# Altium project a2c.PrjPcb
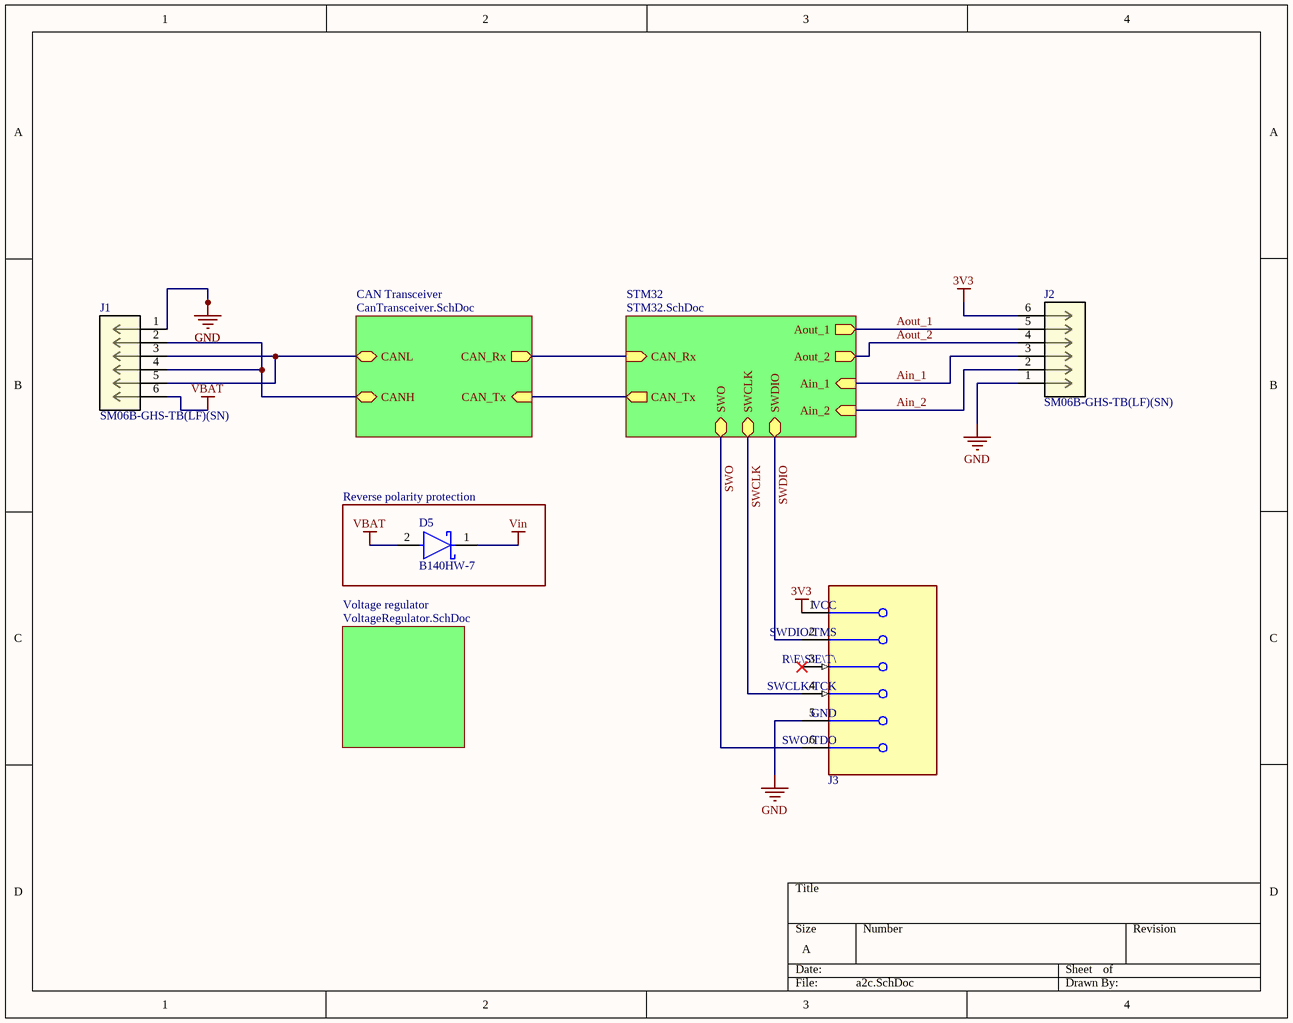
[diagram p0: a2c.SchDoc]
4 sheets, 40 parts. Net scope: hierarchical (ports join the sheet entries above them; power ports are global).
Board file: PCB.PcbDoc
Sheets:
  a2c.SchDoc
    STM32 = STM32.SchDoc
    Voltage regulator = VoltageRegulator.SchDoc
    CAN Transceiver = CanTransceiver.SchDoc

## Sheet a2c.SchDoc
size A; SheetNumber: 1; SheetTotal: 4

### Parts
D5  B140HW-7  [FP-SOD123-MFG]
J1  SM06B-GHS-TB(LF)(SN)  [CONN_SM06B-GHS-TB_JST]
J2  SM06B-GHS-TB(LF)(SN)  [CONN_SM06B-GHS-TB_JST]
J3  TC2030-CTX-NL  [Tag_Connect_0_MFG]  (value not drawn)

### Blocks framed on the sheet
Reverse polarity protection: D5

### Sub-sheets
CAN Transceiver = CanTransceiver.SchDoc: CAN_Tx (in), CAN_Rx (out), CANH (bidir), CANL (bidir)
STM32 = STM32.SchDoc: CAN_Tx (out), CAN_Rx (in), Aout_1 (out), Aout_2 (out), Ain_1 (in), Ain_2 (in), SWDIO (bidir), SWCLK (bidir), SWO (bidir)
Voltage regulator = VoltageRegulator.SchDoc: no entries

### Nets
3V3: J2.6 J3.1(VCC)
GND: J1.1 J2.1 J3.5(GND)
VBAT: D5.2(A) J1.6
Vin: D5.1(C)
Ain_1: J2.3 ; sheet STM32/Ain_1
Ain_2: J2.2 ; sheet STM32/Ain_2
Aout_1: J2.5 ; sheet STM32/Aout_1
Aout_2: J2.4 ; sheet STM32/Aout_2
SWCLK: J3.4(SWCLK/TCK) ; sheet STM32/SWCLK
SWDIO: J3.2(SWDIO/TMS) ; sheet STM32/SWDIO
SWO: J3.6(SWO/TDO) ; sheet STM32/SWO
NetD6_1: J1.3 J1.5 ; sheet CAN Transceiver/CANL
NetD6_2: J1.2 J1.4 ; sheet CAN Transceiver/CANH
NetU1_21: sheet STM32/CAN_Rx, sheet CAN Transceiver/CAN_Rx
NetU1_22: sheet STM32/CAN_Tx, sheet CAN Transceiver/CAN_Tx

Not connected (* = marked no-connect by the designer): J3 3(~{RESET})*

### Library data of the parts
D5 = CMP-12790-000013-1: DIODE SCHOTTKY 40V 1A SOD123; Manufacturer: Diodes Inc.; Peak Reverse Current: 40uA; Value: 120pF; Standoff Height: 0mm; Max Junction Temp: +125°C; Max Surge Forward Current: 16A; RoHS: TRUE; Ipc Land Pattern Name: SOD365155X110-2; Reverse Voltage: 40V; Temperature Range Low: -65°C; Capacitance: 120pF; Temperature Range High: +125°C; Mouser Description: Schottky Diodes & Rectifiers SCHOTTKY RECTIFIER SOD-123 1.0A 40V; ComponentLink2URL: https://www.diodes.com/assets/Datasheets/ds30670.pdf; Automotive: No; Package: SOD123; Octopart: https://octopart.com/b140hw-7-diodes+inc.-325751; Footprint Url: https://www.diodes.com/assets/Package-Files/SOD123.pdf; Max Repetitive Reverse Voltage: 40V; Category: Diode; Device Class L3: Schottky Diodes; Manufacturer Part Number: B140HW-7; Digikey Description: DIODE SCHOTTKY 40V 1A SOD123; Lead Free: Yes; Device Class L1: Discrete Semiconductors; ComponentLink2Description: Datasheet; Forward Current: 1A; Device Class L2: Diodes; Temperature: -65°C to +125°C; Height: 1.45mm
J1 J2 = SM06B-GHS-TB(LF)(SN): No Description Available; Manufacturer: JST; Manufacturer Part Number: B6B-ZR-SM4-TF(LF)(SN); Conn Orientation: Straight; Pitch: 1.5mm; Current Rating: 1A; Number Of Contacts: 6; Conn Gender: Male; Height: 5mm; Device Class L1: Connectors; Device Class L3: unset; Octopart: https://octopart.com/b6b-zr-sm4-tf%28lf%29%28sn%29-jst-248849; Package: B6B-ZR-SM4-TF(LF)(SN); Contact Material: Tin; Automotive: No; ComponentLink2URL: http://www.jst-mfg.com/product/pdf/eng/eZH.pdf; Digikey Description: CONN HEADER SMD 6POS 1.5MM; ComponentLink2Description: Datasheet; Temperature: -25°C to +85°C; Temperature Range Low: -25°C; Temperature Range High: +85°C; Number Of Rows: 1; RoHS: TRUE; Device Class L2: Board to Board Connectors; Lead Free: Yes; Category: Conn; Copyright: Copyright (C) 2021 Ultra Librarian. All rights reserved.; Digi-Key_Part_Number_1: 455-1568-2-ND; Digi-Key_Part_Number_2: 455-1568-1-ND; Digi-Key_Part_Number_3: 455-1568-6-ND; Manufacturer_Part_Number: SM06B-GHS-TB(LF)(SN); Mfr_Name: JST; RefDes: RefDes; Type: DEV

## Sheet STM32.SchDoc
size A; SheetNumber: 2; SheetTotal: 4
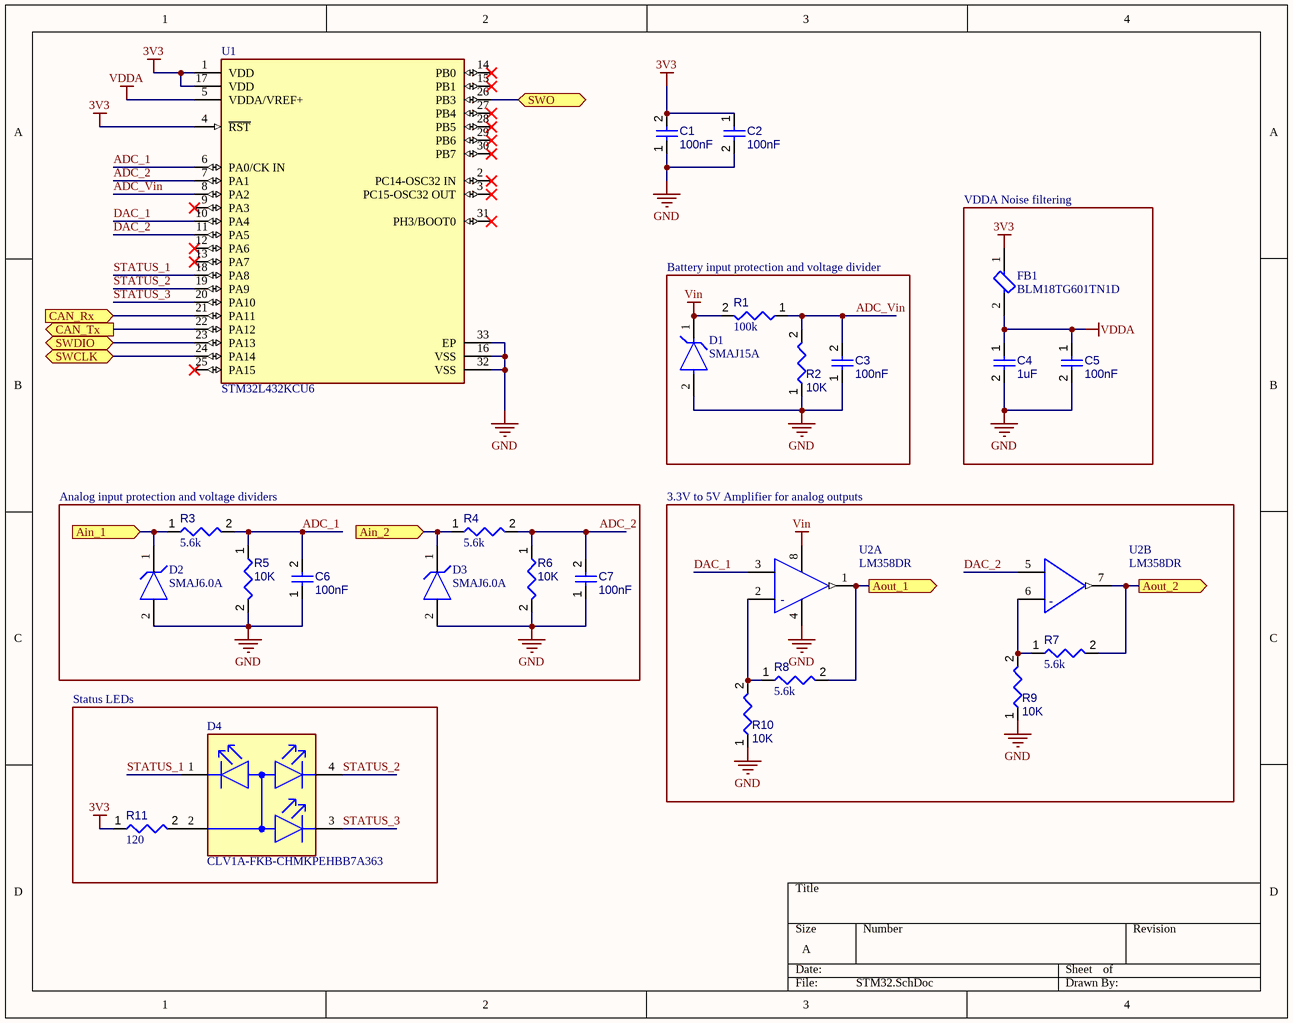
[diagram p1: STM32.SchDoc]

### Parts
C1  100nF  [CAPC0402(1005)60_L]
C2  100nF  [CAPC0402(1005)60_L]
C3  100nF  [CAPC0402(1005)60_L]
C4  1uF  [CAPC0402(1005)60_L]
C5  100nF  [CAPC0402(1005)60_L]
C6  100nF  [CAPC0402(1005)60_L]
C7  100nF  [CAPC0402(1005)60_L]
D1  SMAJ15A  [FP-SMA-MFG]
D2  SMAJ6.0A  [FP-SMA-MFG]
D3  SMAJ6.0A  [FP-SMA-MFG]
D4  CLV1A-FKB-CHMKPEHBB7A363  [FP-CLV1A-FKB-CHMKPEHBB7A3-MFG]
FB1  BLM18TG601TN1D  [FP-BLM18-0_15-0_1-t0_6-MFG]
R1  value 100k  [RESC0402(1005)_L]  (hidden comment: Resistor 100K +/-1 % 0402 63 mW)
R2  10K  [RESC0402(1005)_L]
R3  value 5.6k  [RESC0402(1005)_L]  (hidden comment: Resistor 5K6  +/-5 % 0402 63 mW)
R4  value 5.6k  [RESC0402(1005)_L]  (hidden comment: Resistor 5K6  +/-5 % 0402 63 mW)
R5  10K  [RESC0402(1005)_L]
R6  10K  [RESC0402(1005)_L]
R7  value 5.6k  [RESC0402(1005)_L]  (hidden comment: Resistor 5K6  +/-5 % 0402 63 mW)
R8  value 5.6k  [RESC0402(1005)_L]  (hidden comment: Resistor 5K6  +/-5 % 0402 63 mW)
R9  10K  [RESC0402(1005)_L]
R10  10K  [RESC0402(1005)_L]
R11  value 120  [RESC0603(1608)_L]  (hidden comment: Resistor 120R +/-5 % 0603 0.1 W)
U1  STM32L432KCU6  [FP-UFQFPN32-A0B8-MFG]
U2  LM358DR  [FP-D0008A-MFG]  (parts A,B of 2)

### Blocks framed on the sheet
VDDA Noise filtering: C4 C5 FB1
Battery input protection and voltage divider: C3 D1 R1 R2
Analog input protection and voltage dividers: C6 C7 D2 D3 R3-R6
3.3V to 5V Amplifier for analog outputs: R7-R10 U2
Status LEDs: D4 R11

### Ports
Ain_1 (in), Ain_2 (in), Aout_1 (out), Aout_2 (out), CAN_Rx (in), CAN_Tx (out), SWCLK (bidir), SWDIO (bidir), SWO (bidir)

### Nets
3V3: C1.2 C2.1 FB1.1 R11.1 U1.1(VDD) U1.4(~{RST}) U1.17(VDD)
GND: C1.1 C2.2 C3.1 C4.2 C5.2 C6.1 C7.1 D1.2(A) D2.2(A) D3.2(A) R2.1 R5.2 R6.2 R9.1 R10.1 U1.16(VSS) U1.32(VSS) U1.33(EP) U2.4(V-)
VDDA: C4.1 C5.1 FB1.2 U1.5(VDDA/VREF+)
Vin: D1.1(C) R1.2 U2.8(V+)
ADC_1: C6.2 R3.2 R5.1 U1.6(PA0/CK_IN)
ADC_2: C7.2 R4.2 R6.1 U1.7(PA1)
ADC_Vin: C3.2 R1.1 R2.2 U1.8(PA2)
Ain_1: D2.1(C) R3.1 ; port Ain_1
Ain_2: D3.1(C) R4.1 ; port Ain_2
Aout_1: R8.2 U2.1(1OUT) ; port Aout_1
Aout_2: R7.2 U2.7(2OUT) ; port Aout_2
DAC_1: U1.10(PA4) U2.3(IN1+)
DAC_2: U1.11(PA5) U2.5(IN2+)
STATUS_1: D4.1(RED(C)) U1.18(PA8)
STATUS_2: D4.4(GREEN(C)) U1.19(PA9)
STATUS_3: D4.3(BLUE(C)) U1.20(PA10)
SWCLK: U1.24(PA14) ; port SWCLK
SWDIO: U1.23(PA13) ; port SWDIO
SWO: U1.26(PB3) ; port SWO
NetD4_2: D4.2(COMMON_ANODE) R11.2
NetR7_1: R7.1 R9.2 U2.6(IN2-)
NetR8_1: R8.1 R10.2 U2.2(IN1-)
NetU1_21: U1.21(PA11) ; port CAN_Rx
NetU1_22: U1.22(PA12) ; port CAN_Tx

Not connected (* = marked no-connect by the designer): U1 2(PC14-OSC32_IN)* 3(PC15-OSC32_OUT)* 9(PA3)* 12(PA6)* 13(PA7)* 14(PB0)* 15(PB1)* 25(PA15)* 27(PB4)* 28(PB5)* 29(PB6)* 30(PB7)* 31(PH3/BOOT0)*

### Notes on the sheet
- (in symbol CMP-1685-00009-2, part A) -
- (in symbol CMP-1685-00009-2, part B) -

### Library data of the parts
C1-C3 C5-C7 = CMP-001-00061-2: Chip Capacitor, 100nF +/-20%, 10V, 0402, Thickness 0.6 mm; Tolerance: 20%; Max Operating Temperature: 85°C; Min Operating Temperature: -55°C; Voltage Rating: 10V; Case/Package: 0402; Mounting Technology: SMT; Pins: 2; Value: 100nF
C4 = CMP-001-00063-2: Chip Capacitor, 1µF +/-20%, 10V, 0402, Thickness 0.6 mm; Tolerance: 10%; Max Operating Temperature: 85°C; Case/Package: 0402; Voltage Rating: 10V; Min Operating Temperature: -55°C; Mounting Technology: SMT; Pins: 2; Value: 1µF
D1 = CMP-07401-000026-1: TVS DIODE 15V 24.4V SMA; Manufacturer: Bourns Inc.; Max Junction Temp: +150°C; Peak Pulse Current: 16.4A; Direction: Unidirectional; Breakdown Voltage: 16.7V; Number Of Channels: 1; Peak Pulse Power: 400W; Mouser Description: Bourns Smaj15a / Diode Tvs 15v 400w Uni 5% Smd Bourns; Temperature Range Low: -55°C; ComponentLink2Description: Datasheet; Package: SMA; Reverse Standoff Voltage: 15V; Category: Diode; Device Class L2: TVS Diodes; Lead Free: Yes; RoHS: TRUE; Clamping Voltage: 24.4V; ComponentLink2URL: https://www.bourns.com/docs/Product-Datasheets/SMAJ.pdf; Digikey Description: TVS DIODE 15V 24.4V SMA; Temperature Range High: +150°C; Height: 2.29mm; Device Class L1: Circuit Protection; Device Class L3: unset; Temperature: -55°C to +150°C; Octopart: https://octopart.com/smaj15a-bourns-12809353; Manufacturer Part Number: SMAJ15A; Automotive: No
D2 D3 = CMP-07401-000002-1: TVS DIODE 6V 10.3V SMA; Manufacturer: Bourns Inc.; Max Junction Temp: +150°C; Peak Pulse Power: 400W; Breakdown Voltage: 6.67V; Peak Pulse Current: 38.8A; Direction: Unidirectional; Number Of Channels: 1; Clamping Voltage: 10.3V; Digikey Description: TVS DIODE 6V 10.3V SMA; Automotive: No; Octopart: https://octopart.com/smaj6.0a-bourns-12809397; Package: SMA; Temperature Range High: +150°C; Manufacturer Part Number: SMAJ6.0A; Device Class L2: TVS Diodes; Temperature Range Low: -55°C; ComponentLink2URL: https://www.bourns.com/docs/product-datasheets/smaj.pdf?sfvrsn=d2266a96_11; Lead Free: Yes; Device Class L1: Circuit Protection; Mouser Description: Diode TVS Single Uni-Dir 6V 400W 2-Pin SMA T/R; RoHS: TRUE; Height: 2.29mm; Category: Diode; Temperature: -55°C to +150°C; Reverse Standoff Voltage: 6V; ComponentLink2Description: Datasheet; Device Class L3: unset
D4 = CMP-13977-000017-1: LED RGB 4PLCC SMD; Lens Color: White; Number of Elements: 3; Dominant Wavelength: 470nm; Forward Voltage: 3.2V; Luminous Intensity: 315mcd; Lens Style: Round; Viewing Angle: 120°; Number of LEDs: 1; Test Current: 20mA; Lens Transparency: Diffused; Reverse Voltage: 5V; Color: Blue; Height: 2.1mm; Package Quantity: 2000; Length: 2.8mm; Number of Pins: 4; Packaging: Tape and Reel; Width: 2.8mm; Radiation Hardening: No; Depth: 3.2mm; Mount: Surface Mount; Min Operating Temperature: -40°C; Forward Current: 20mA; Max Operating Temperature: 100°C; Case/Package: PLCC
FB1 = CMP-0686-00527-3: FERRITE BEAD 600 OHM 0603 1LN; Current Rating: 200mA; Test Frequency: 100MHz; Tolerance: 25%; Impedance: 600R; DC Resistance (DCR): 450mR; Number of Lines: 1; Material: Steel; Number of Pins: 2; Height: 0.8mm; Max Operating Temperature: 125°C; Case Code (Imperial): 0603; Case/Package: 0603; REACH SVHC: No SVHC; Max Current Rating: 200mA; Width: 0.8mm; Package Quantity: 10000; Depth: 0.8mm; Length: 1.6mm; Lead Free: Lead Free; Max DC Current: 200mA; Min Operating Temperature: -55°C; Number of Circuits: 1; Termination: SMD/SMT; Case Code (Metric): 1608; Packaging: Tape and Reel
R1 = CMP-009-00168-2: Chip Resistor, 100 kOhms, +/-1 %, 63 mW, -55 to 155 degC, 0402; Power: 63mW; Tolerance: 1%; Pins: 2; Min Operating Temperature: -55°C; Max Operating Temperature: 155°C; Case/Package: 0402
R2 R5 R6 R9 R10 = CMP-009-00149-2: Chip Resistor, 10 kOhms, +/-1 %, 63 mW, -55 to 125 degC, 0402; Power: 63mW; Tolerance: 1%; Max Operating Temperature: 155°C; Min Operating Temperature: -55°C; Case/Package: 0402; Pins: 2; Value: 10k
R3 R4 R7 R8 = CMP-009-00136-2: Chip Resistor, 5,6 kOhms, +/-5 %, 63 mW, -55 to 155 degC, 0402; Tolerance: 5%; Power: 63mW; Pins: 2; Case/Package: 0402; Min Operating Temperature: -55°C; Max Operating Temperature: 155°C
R11 = CMP-009-00176-2: Chip Resistor, 120 Ohms, +/-5 %, 0.1 W, -55 to 155 degC, 0603; Power: 100mW; Tolerance: 5%; Case/Package: 0603; Max Operating Temperature: 155°C; Pins: 2; Min Operating Temperature: -55°C
U1 = CMP-12105-000033-1: IC MCU 32BIT 256KB FLASH 32QFPN; Manufacturer: STMicroelectronics; Max Supply Voltage: 3.6V; Number Of Timers/Counters: 11; Ram Size: 64KBytes; Number Of Usb Channels: 1; Memory Size: 256KBytes; Number Of Uart Channels: 3; Frequency: 80MHz; Number Of I2C Channels: 2; Core Architecture: ARM Cortex-M4; Number Of I/Os: 26; Min Supply Voltage: 1.62V; Data Bus Width: 32bits; Max Junction Temp: +105°C; Interface: I2C,SPI,UART,USART,CAN,USB,LIN,IrDA,Other; Ambient Temperature Range High: +85°C; Category: IC; Device Class L2: Embedded Processors and Controllers; Ambient Temperature Range Low: -40°C; Number Of Adc Channels: 11; ComponentLink2Description: Datasheet; Number Of A/D Converters: 1; Device Class L1: Integrated Circuits (ICs); Memory Type: FLASH; Height: 0.6mm; Temperature: -40°C to +105°C; Automotive: No; Temperature Range Low: -40°C; Digikey Description: IC MCU 32BIT 256KB FLASH 32QFPN; Manufacturer Part Number: STM32L432KCU6; Temperature Range High: +105°C; Octopart: https://octopart.com/stm32l432kcu6-stmicroelectronics-71093510; Device Class L3: Microcontrollers; Number Of Pwm Channels: 1; Number Of Spi Channels: 2; Lead Free: Yes; Number Of Cores: 1; Package: UFQFPN32-A0B8; ComponentLink2URL: https://www.st.com/content/ccc/resource/technical/document/datasheet/24/01/9f/59/f0/83/47/fc/DM00257205.pdf/files/DM00257205.pdf/jcr:content/translations/en.DM00257205.pdf; RoHS: TRUE
U2 = CMP-1685-00009-2: IC OPAMP GP 2 CIRCUIT 8SOIC; Output Current: 30mA; Min Dual Supply Voltage: 1.5V; Input Offset Voltage (Vos): 7mV; Power Supply Rejection Ratio (PSRR): 65dB; Unity Gain Bandwidth Product: 700kHz; Number of Channels: 2; Min Supply Voltage: 3V; Max Dual Supply Voltage: 16V; Dual Supply Voltage: 9V; Max Supply Voltage: 32V; Nominal Supply Current: 1.2mA; Slew Rate: 0.3V/µs; Input Bias Current: 250nA; Voltage Gain: 100dB; Operating Supply Current: 1mA; REACH SVHC: No SVHC; Package Quantity: 2500; Width: 3.91mm; Max Operating Temperature: 70°C; Min Operating Temperature: 0°C; Mount: Surface Mount; Length: 4.9mm; Radiation Hardening: No; Case/Package: SOIC; Lead Free: Lead Free; Number of Elements: 2; Packaging: Tape and Reel; Output Current per Channel: 30mA; Number of Circuits: 2; Bandwidth: 700kHz; Operating Supply Voltage: 16V; Gain Bandwidth Product: 700kHz; Number of Pins: 8; Number of Amplifiers: 2; Height: 1.58mm; Common Mode Rejection Ratio: 65dB; Contact Plating: Gold

## Sheet VoltageRegulator.SchDoc
size A; SheetNumber: 4; SheetTotal: 4
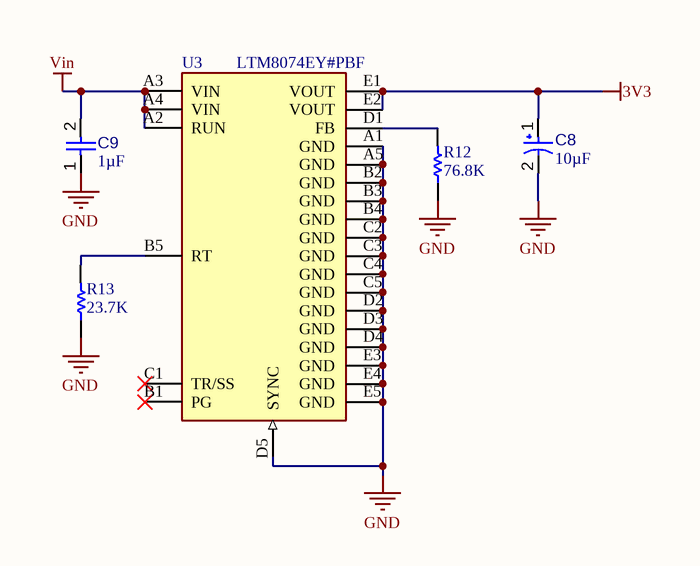
[diagram p2: VoltageRegulator.SchDoc]

### Parts
C8  value 10µF  [CAPMP3217X18-T_V]  (hidden comment: TAJA106K016RNJ)
C9  value 1µF  [CAPC0603(1608)100_L]  (hidden comment: Capacitor 1µF +/-40% 50V 0603)
R12  76.8K  [RESC1609X50X30ML10T20]
R13  23.7K  [RESC1608X55X30ML15T15]
U3  LTM8074EY#PBF  [FP-BGA-25-05-08-1566-MFG]

### Nets
3V3: C8.1 U3.E1(VOUT) U3.E2(VOUT)
GND: C8.2 C9.1 R12.1 R13.1 U3.A1(GND) U3.A5(GND) U3.B2(GND) U3.B3(GND) U3.B4(GND) U3.C2(GND) U3.C3(GND) U3.C4(GND) U3.C5(GND) U3.D2(GND) U3.D3(GND) U3.D4(GND) U3.D5(SYNC) U3.E3(GND) U3.E4(GND) U3.E5(GND)
Vin: C9.2 U3.A2(RUN) U3.A3(VIN) U3.A4(VIN)
NetR12_2: R12.2 U3.D1(FB)
NetR13_2: R13.2 U3.B5(RT)

Not connected (* = marked no-connect by the designer): U3 B1(PG)* C1(TR/SS)*

### Library data of the parts
C8 = CMP-001-00041-6: Standard Tantalum, 10 uF, +/- 10%, 16 V, -55 to 125 degC, 1206 (3216 Metric), RoHS, Tape and Reel; Manufacturer: AVX; Voltage Rating: 16V; ESR: 3Ohm; RoHS Compliant: True; Tolerance: 10%; Mounting Technology: SM; Min Operating Temperature: -55°C; Capacitor Type: Tantalum; Max Operating Temperature: 125°C; Case/Package: 1206; Pins: 2; Datasheet URL: http://datasheets.avx.com/TAJ.pdf; Datasheet Version: Feb-16; Manufacturer URL: http://www.avx.com/; Package Description: 2-Pin Surface Mount Device, Body 3.2 x 1.65 mm; Package Quantity: 1; Package Reference: CAPMP3217X18-T; Package URL: http://www.avx.com/download/software/literature/AVX-Footprint-Library.pdf; Packaging: TapeandReel
C9 = CMP-001-00078-3: Chip Capacitor, 1µF +/-40%, 50V, 0603, Thickness 1 mm; Tolerance: 10%; Voltage Rating: 50V; Mounting Technology: SMT; Max Operating Temperature: 85°C; Case/Package: 0603; Pins: 2; Min Operating Temperature: -55°C
R12 = CMP-1012-00723-2: Part Number: CRCW060376K8FKEA; Manufacturer: Vishay Dale
R13 = CMP-2000-00357-1: Part Number: ERJ-3EKF2372V; Manufacturer: Panasonic
U3 = CMP-09139-000015-1: IC REG BUCK ADJ 1.2A 25BGA; Manufacturer: Analog Devices; Output Type: AdjustableProgrammable; Standoff Height: 0.23mm; Number Of Outputs: 1; Min Supply Voltage: 3.2V; Switching Frequency: 200-2200kHz; Max Junction Temp: +125°C; Output Voltage: 0.8-12V; Nominal Supply Current: 3-8uA; Max Supply Voltage: 40V; Output Current: 1.2A; Lead Free: Yes; Device Class L3: Voltage Regulators - Switching; Device Class L1: Integrated Circuits (ICs); Ipc Land Pattern Name: BGA25N65P5X5_400X400X182; Temperature Range Low: -40°C; Category: IC; Automotive: No; Height: 1.98mm; Device Class L2: Power Management ICs; Switching Topology: Buck; Temperature Range High: +125°C; Digikey Description: IC REG BUCK ADJ 1.2A 25BGA; RoHS: TRUE; Temperature: -40°C to +125°C; ComponentLink2Description: Datasheet; Octopart: https://octopart.com/ltm8074ey%23pbf-analog+devices-95880170; Manufacturer Part Number: LTM8074EY#PBF; Mouser Description: Conv DC-DC 3.2V to 40V Step Down Single-Out 0.8V to 12V 1.2A uModule Automotive 25-Pin BGA Tray; ComponentLink2URL: https://www.analog.com/media/en/technical-documentation/data-sheets/LTM8074.pdf; Package: BGA-25-05-08-1566

## Sheet CanTransceiver.SchDoc
size A; SheetNumber: 3; SheetTotal: 4
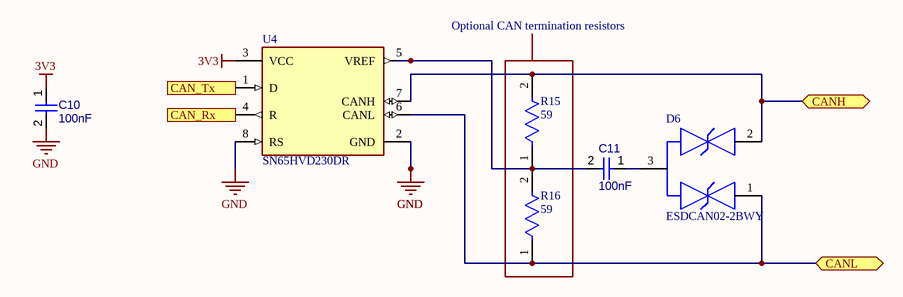
[diagram p3: CanTransceiver.SchDoc]

### Parts
C10  100nF  [CAPC0402(1005)60_L]
C11  100nF  [CAPC0402(1005)60_L]
D6  ESDCAN02-2BWY  [FP-SOT323-3L-MFG]
R15  59  [FP-CRCW0805-e3-IPC_B]
R16  59  [FP-CRCW0805-e3-IPC_B]
U4  SN65HVD230DR  [FP-D0008A-IPC_A]

### Ports
CAN_Rx (out), CAN_Tx (in), CANH (bidir), CANL (bidir)

### Nets
3V3: C10.1 U4.3(VCC)
GND: C10.2 U4.2(GND) U4.8(RS)
NetC11_1: C11.1 D6.3
NetC11_2: C11.2 R15.1 R16.2 U4.5(VREF)
NetD6_1: D6.1 R16.1 U4.6(CANL) ; port CANL
NetD6_2: D6.2 R15.2 U4.7(CANH) ; port CANH
NetU1_21: U4.4(R) ; port CAN_Rx
NetU1_22: U4.1(D) ; port CAN_Tx

### Notes on the sheet
- Optional CAN termination resistors

### Library data of the parts
C10 C11 = CMP-001-00061-2: as C1 on sheet STM32; Max Operating Temperature: 85°C; Min Operating Temperature: -55°C; Voltage Rating: 10V; Case/Package: 0402; Mounting Technology: SMT; Pins: 2; Value: 100nF
D6 = CMP-12225-000055-1: TVS DIODE 26.5V 44V SOT323-3; Manufacturer: STMicroelectronics; Value: 3pF; Direction: Bidirectional; Breakdown Voltage: 28.5V; Automotive Grade: Grade 0; Standoff Height: 0mm; Peak Pulse Power: 170W; Peak Pulse Current: 3A; Number Of Channels: 2; Max Junction Temp: +175°C; Mouser Description: TVS Diodes / ESD Suppressors Automotive dual-line Transil, Transient voltage suppressor (TVS) for CAN bus; Height: 1.1mm; Category: Diode; Reverse Standoff Voltage: 26.5V; Device Class L1: Circuit Protection; Temperature: -55°C to +175°C; RoHS: TRUE; ComponentLink2URL: https://www.st.com/resource/en/datasheet/esdcan02-2bwy.pdf; Device Class L3: unset; Device Class L2: TVS Diodes; Temperature Range High: +175°C; Octopart: https://octopart.com/esdcan02-2bwy-stmicroelectronics-58631133; Ipc Land Pattern Name: SOT65P210X95-3; Temperature Range Low: -55°C; Capacitance: 3pF; Digikey Description: TVS DIODE 26.5V 44V SOT323-3; Automotive: Yes; ComponentLink2Description: Datasheet; Clamping Voltage: 44V; Manufacturer Part Number: ESDCAN02-2BWY; Lead Free: Yes; Package: SOT323-3L
R15 R16 = CMP-02407-002414-1: RES Thick Film, 59Ω, 1%, 0.125W, 100ppm/°C, 0805; Power Rating: 125mW; Voltage Rating (DC): 150V; Resistance: 59R; Length: 2mm; Mount: Surface Mount; Military Standard: Not; Min Operating Temperature: -55°C; Number of Pins: 2; Height: 0.02inch; Weight: 0.000194oz; Case Code (Metric): 2012; Features: Automotive AEC-Q200; Width: 1.25mm; Tolerance: 1%; Max Operating Temperature: 155°C; Temperature Coefficient: 100ppm/°C; Depth: 1.25mm; Termination: SMD/SMT; Package Quantity: 10; Number of Terminations: 2; Packaging: Tape and Reel; Radiation Hardening: No; Composition: Thick Film; Lead Free: Lead Free; Case Code (Imperial): 0805; Case/Package: 0805; Contact Plating: Tin; Max Power Dissipation: 125mW; Voltage Rating: 150V
U4 = CMP-0315-00015-3: IC TRANSCEIVER HALF 1/1 8SOIC; Number of Transceivers: 1; Operating Supply Voltage: 3.3V; Number of I/Os: 2; Max Supply Current: 17mA; Max Supply Voltage: 3.6V; Min Supply Voltage: 3V; Data Rate: 1Mbps; Min Operating Temperature: -40°C; Packaging: Tape and Reel; Lead Free: Lead Free; Number of Transmit Buffers: 1; Max Operating Temperature: 85°C; Number of Receive Buffers: 1; Number of Pins: 8; Package Quantity: 1; Radiation Hardening: No; Case/Package: D; REACH SVHC: No SVHC; Weight: 0.002561oz; Termination: SMD/SMT; Contact Plating: Gold; Nominal Supply Current: 17mA; Number of Receivers: 1; Number of Drivers: 1

## Nets that join several sheets
3V3: a2c (J2.6 J3.1), STM32 (7 pins), VoltageRegulator (C8.1 U3.E1 U3.E2), CanTransceiver (C10.1 U4.3)
GND: a2c (J1.1 J2.1 J3.5), STM32 (19 pins), VoltageRegulator (20 pins), CanTransceiver (C10.2 U4.2 U4.8)
Vin: a2c (D5.1), STM32 (D1.1 R1.2 U2.8), VoltageRegulator (C9.2 U3.A2 U3.A3 U3.A4)
Ain_1: a2c (J2.3), STM32 (D2.1 R3.1)
Ain_2: a2c (J2.2), STM32 (D3.1 R4.1)
Aout_1: a2c (J2.5), STM32 (R8.2 U2.1)
Aout_2: a2c (J2.4), STM32 (R7.2 U2.7)
NetD6_1: a2c (J1.3 J1.5), CanTransceiver (D6.1 R16.1 U4.6)
NetD6_2: a2c (J1.2 J1.4), CanTransceiver (D6.2 R15.2 U4.7)
NetU1_21: STM32 (U1.21), CanTransceiver (U4.4)
NetU1_22: STM32 (U1.22), CanTransceiver (U4.1)
SWCLK: a2c (J3.4), STM32 (U1.24)
SWDIO: a2c (J3.2), STM32 (U1.23)
SWO: a2c (J3.6), STM32 (U1.26)